# EAGLE design hackerling_b (EAGLE 6.4)
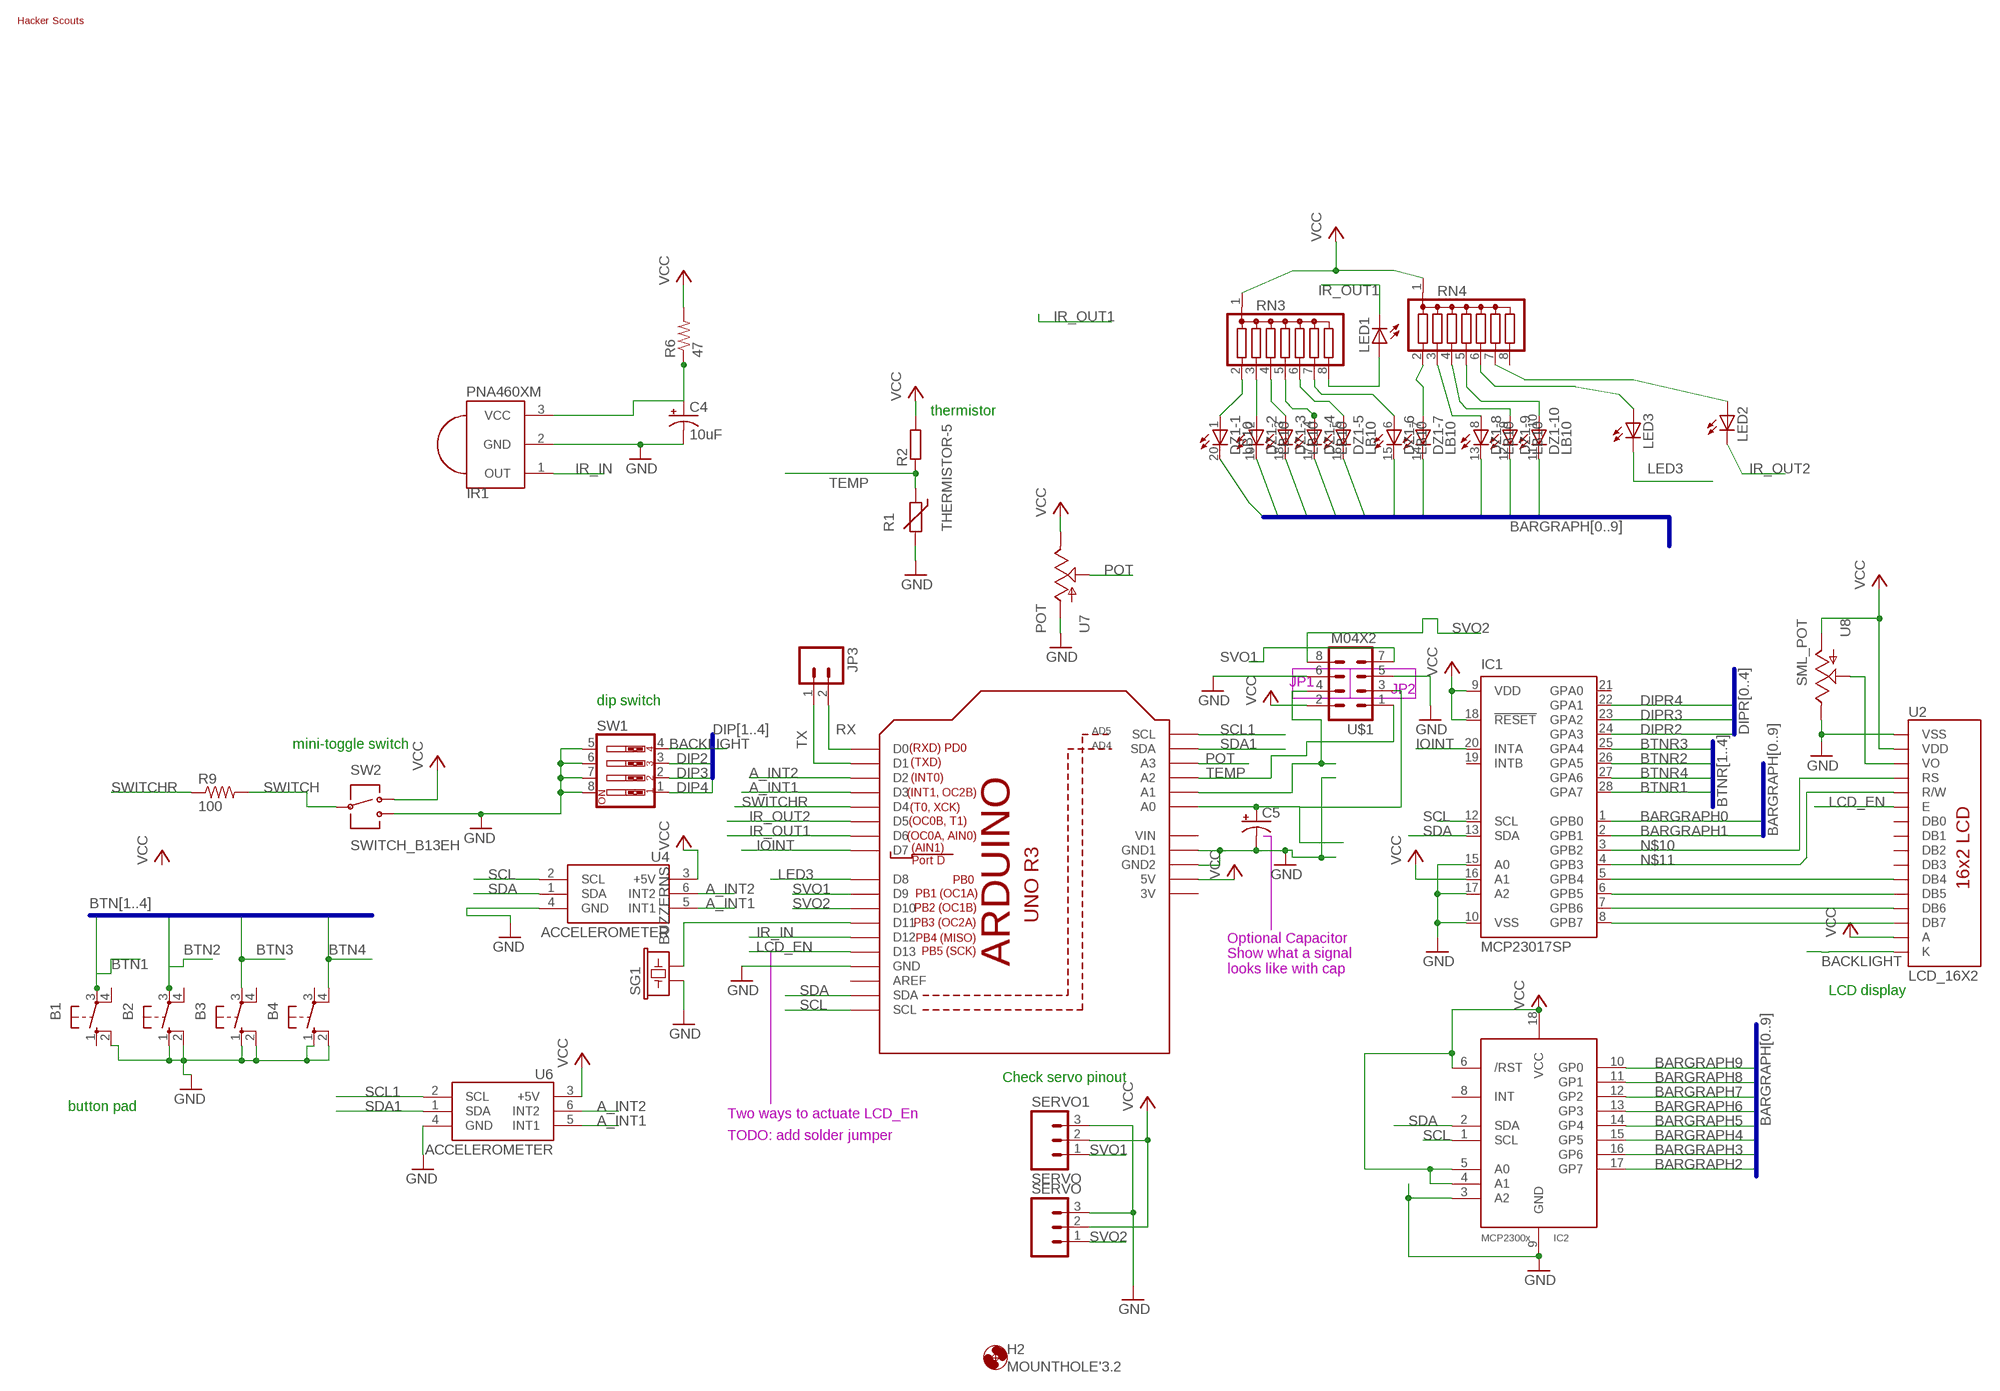
[diagram p0: schematic, sheet 1, part 1 of 2]
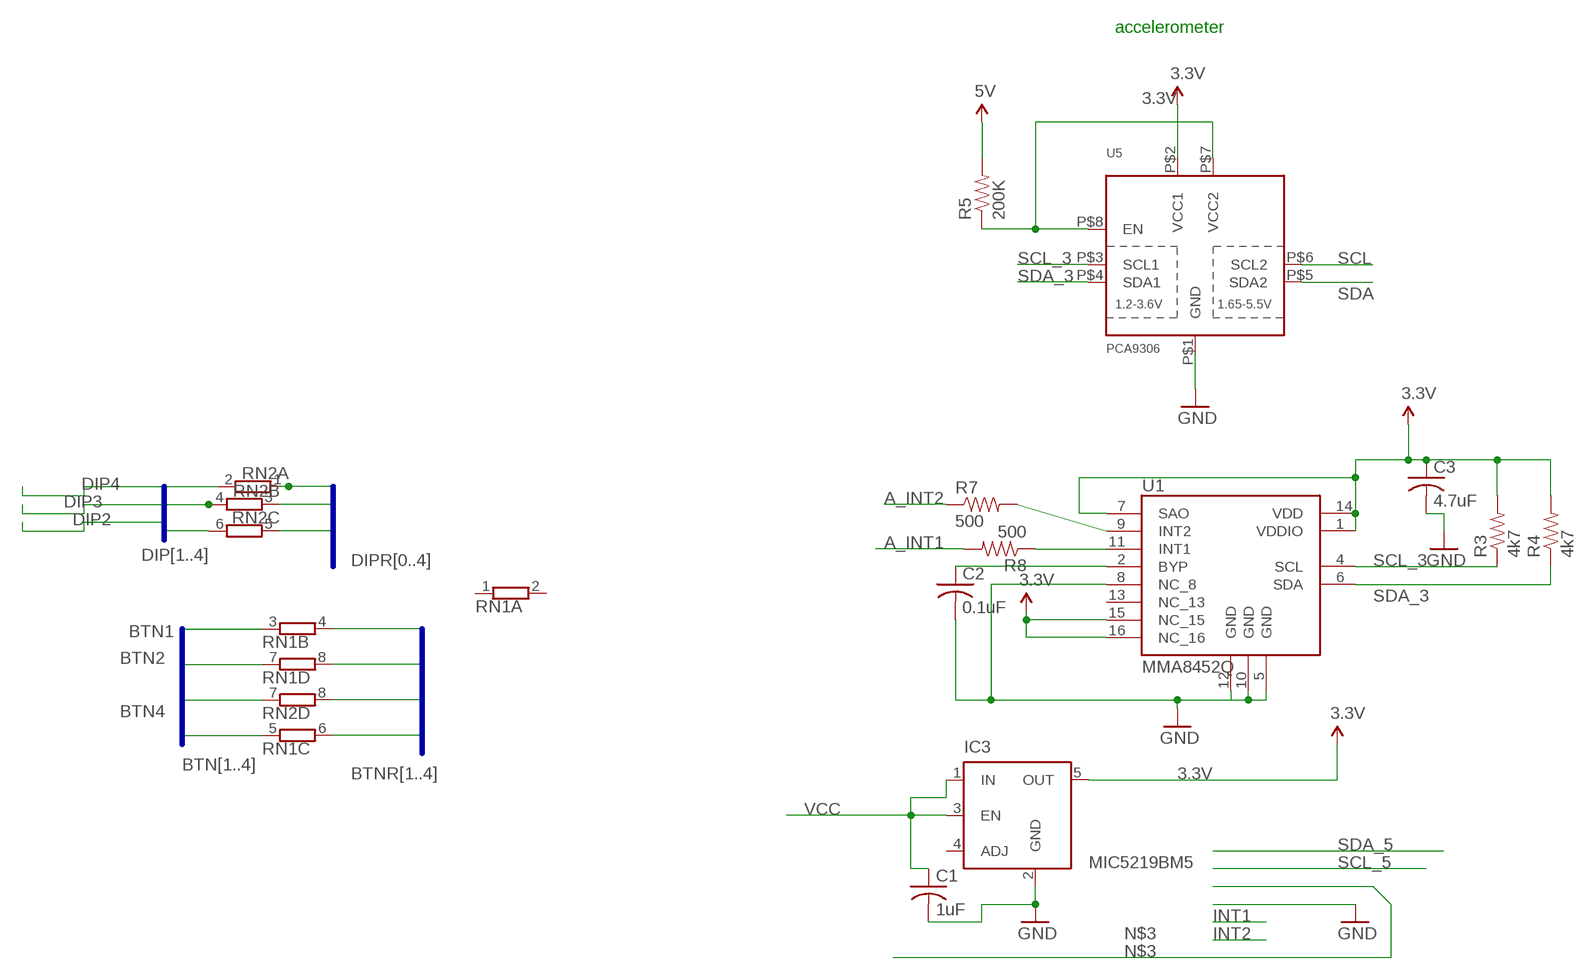
[diagram p1: schematic, sheet 1, part 2 of 2]

## Parts
B1  SWITCH_BCF-4000  [SWITCH_B3F-4000]
B2  SWITCH_BCF-4000  [SWITCH_B3F-4000]
B3  SWITCH_BCF-4000  [SWITCH_B3F-4000]
B4  SWITCH_BCF-4000  [SWITCH_B3F-4000]
C1  1uF  C-USC0603K  [C0603K]
C2  0.1uF  C-USC0603K  [C0603K]
C3  4.7uF  C-USC0603K  [C0603K]
C4  10uF  CAP_050X075  [CAP_050X075]
C5  CPOL-USE5-4  [E5-4]
DZ1  LB10  [LB10]
H2  MOUNTHOLE'3.2  [HOLE_3.2]
HACKERSCOUTSLOGO  HS-LOGO  [HS-LOGO-SM-NOTEXT]
IC1  MCP23017SP  [DIL28-3]
IC2  MCP2300X/P  [DIL18]
IC3  MIC5219BM5  [SOT23-5]
IR1  PNA460XM  [PNA460XM]
JP3  M02LOCK  [1X02_LOCK]
LED1  LED5MM  [LED5MM]
LED2  LED5MM  [LED5MM]
LED3  LED5MM  [LED5MM]
R1  THERMISTOR-5  [R-5]
R2  R-EU_0204/7  [0204/7]
R3  4k7  RESISTOR0603-RES  [0603-RES]
R4  4k7  RESISTOR0603-RES  [0603-RES]
R5  200K  RESISTOR0603-RES  [0603-RES]
R6  47  R-US_0204/7  [0204/7]
R7  500  RESISTOR0603-RES  [0603-RES]
R8  500  RESISTOR0603-RES  [0603-RES]
R9  100  R-US_0204/7  [0204/7]
RN1  E4R  [SIL8]
RN2  E4R  [SIL8]
RN3  G07R  [SIL8]
RN4  G07R  [SIL8]
SERVO  M03LOCK  [1X03_LOCK]
SERVO1  SERVO  M03LOCK  [1X03_LOCK]
SG1  BUZZERNS  [BUZZER-12MM-NS]
SW1  SW_DIP-4  [EDG-04]
SW2  SWITCH_B13EH  [SWITCH_B13EH]
U1  MMA8452Q  [QFN-16(5X3)]
U2  LCD_16X2  [LCD_16X2]
U3  ARDUINOR3-BPLACE  [ARDUINOR3-BPLACE]
U4  ACCELEROMETER  [ACCELEROMETER]
U5  PCA9306  [VSSOP-8]
U6  ACCELEROMETER  [ACCELEROMETER]
U7  POT  [ALS_POT]
U8  SML_POT  [SML_POT]
U$1  M04X2  [2X4]

## Nets
3.3V: C3.1 IC3.5(OUT) R3.2 R4.2 U1.1(VDDIO) U1.7(SAO) U1.14(VDD) U1.15(NC_15) U1.16(NC_16) U5.P$2(VCC1)
A_INT1: R8.2 U3.D3 U4.5(INT1) U6.5(INT1)
A_INT2: R7.1 U3.D2 U4.6(INT2) U6.6(INT2)
BACKLIGHT: SW1.4 U2.16(K)
BARGRAPH0: DZ1.20(-1:C) IC1.1(GPB0)
BARGRAPH1: DZ1.19(-2:C) IC1.2(GPB1)
BARGRAPH2: DZ1.18(-3:C) IC2.17(GP7)
BARGRAPH3: DZ1.17(-4:C) IC2.16(GP6)
BARGRAPH4: DZ1.16(-5:C) IC2.15(GP5)
BARGRAPH5: DZ1.15(-6:C) IC2.14(GP4)
BARGRAPH6: DZ1.14(-7:C) IC2.13(GP3)
BARGRAPH7: DZ1.13(-8:C) IC2.12(GP2)
BARGRAPH8: DZ1.12(-9:C) IC2.11(GP1)
BARGRAPH9: DZ1.11(-10:C) IC2.10(GP0)
BTN1: B1.3(P) RN1.3
BTN2: B2.3(P) RN1.7
BTN3: B3.3(P) RN2.7
BTN4: B4.4(P1) RN1.5
BTNR1: IC1.28(GPA7) RN1.4
BTNR2: IC1.26(GPA5) RN1.8
BTNR3: IC1.25(GPA4) RN2.8
BTNR4: IC1.27(GPA6) RN1.6
DIP2: RN2.6 SW1.3
DIP3: RN2.4 SW1.2
DIP4: RN2.2 SW1.1
DIPR2: IC1.24(GPA3) RN2.5
DIPR3: IC1.23(GPA2) RN2.3
DIPR4: IC1.22(GPA1) RN2.1
GND: B1.2(S1) B2.1(S) B2.2(S1) B3.1(S) B3.2(S1) B4.1(S) B4.2(S1) C1.2 C2.2 C3.2 C4.2(-) C5.- IC1.10(VSS) IC1.15(A0) IC1.17(A2) IC2.3(A2) IC2.9(GND) IC3.2(GND) IR1.2(GND) R1.2 SERVO1.3 SERVO.3 SG1.+ SW1.5 SW1.6 SW1.7 SW1.8 SW2.3 U1.5(GND) U1.8(NC_8) U1.10(GND) U1.12(GND) U2.1(VSS) U2.B1(VSS) U3.GND U3.GND1 U3.GND2 U4.4(GND) U5.P$1(GND) U6.4(GND) U7.P$1(A) U8.E U$1.5 U$1.6
IOINT: IC1.20(INTA) U3.D7
IR_IN: IR1.1(OUT) U3.D12
IR_OUT1: LED1.K(C) U3.D6
IR_OUT2: LED2.K(C) U3.D5
LCD_EN: U2.6(E) U3.D13
LED3: LED3.K(C) U3.D8
N$1: IC1.8(GPB7) U2.14(DB7)
N$2: IC1.7(GPB6) U2.13(DB6) U2.B13(DB6)
N$3: IC1.6(GPB5) U2.12(DB5) U2.B12(DB5)
N$4: IC1.5(GPB4) U2.11(DB4)
N$5: R5.1 U5.P$7(VCC2) U5.P$8(EN)
N$6: R7.2 U1.9(INT2)
N$7: R8.1 U1.11(INT1)
N$8: DZ1.2(-2:A) RN3.3
N$9: DZ1.3(-3:A) RN3.4
N$10: IC1.3(GPB2) U2.4(RS)
N$11: IC1.4(GPB3) U2.5(R/W)
N$12: LED2.A RN4.7
N$13: U2.3(VO) U8.S
N$15: SG1.- U3.D11
N$16: DZ1.7(-7:A) RN4.2
N$17: DZ1.6(-6:A) RN3.7
N$18: DZ1.1(-1:A) RN3.2
N$19: C4.1(+) IR1.3(VCC) R6.1
N$20: LED3.A RN4.6
N$21: DZ1.4(-4:A) RN3.5
N$22: DZ1.5(-5:A) RN3.6
N$24: U3.A1 U$1.4
N$25: C2.1 U1.2(BYP)
N$26: C5.+ U3.A0 U$1.3
N$29: DZ1.8(-8:A) RN4.3
N$30: DZ1.9(-9:A) RN4.4
N$31: DZ1.10(-10:A) RN4.5
N$32: LED1.A RN3.8
POT: U3.A3 U7.P$2(S)
RX: JP3.2 U3.D0
SCL: IC1.12(SCL) IC2.1(SCL) U3.SCL U4.2(SCL) U5.P$6(SCL2)
SCL1: U3.A5(SCL) U6.2(SCL)
SCL_3: R3.1 U1.4(SCL) U5.P$3(SCL1)
SDA: IC1.13(SDA) IC2.2(SDA) U3.SDA U4.1(SDA) U5.P$5(SDA2)
SDA1: U3.A4(SDA) U6.1(SDA)
SDA_3: R4.1 U1.6(SDA) U5.P$4(SDA1)
SVO1: SERVO1.1 U3.D9 U$1.7
SVO2: SERVO.1 U3.D10 U$1.8
SWITCH: R9.2 SW2.2
SWITCHR: R9.1 U3.D4
TEMP: R1.1 R2.1 U3.A2 U$1.1
TX: JP3.1 U3.D1
VCC: C1.1 IC1.9(VDD) IC1.16(A1) IC1.18(!RESET) IC2.4(A1) IC2.5(A0) IC2.6(/RST) IC2.18(VCC) IC3.1(IN) IC3.3(EN) R2.2 R5.2 R6.2 RN3.1 RN4.1 SERVO1.2 SERVO.2 SW2.1 U2.2(VDD) U2.15(A) U2.B2(VDD) U3.5V U4.3(+5V) U6.3(+5V) U7.P$3(E) U8.A U$1.2 ; supply symbol labelled 5V
Unconnected: B1.1(S) B1.4(P1) B2.4(P1) B3.4(P1) B4.3(P) IC1.19(INTB) IC1.21(GPA0) IC2.8(INT) IC3.4(ADJ) RN1.1 RN1.2 RN4.8 U1.13(NC_13) U2.7(DB0) U2.8(DB1) U2.9(DB2) U2.10(DB3) U3.AREF

## Buses
BARGRAPH[0..9]
DIPR[0..4]
BTN[1..4]
BTNR[1..4]
DIP[1..4]

## Notes on the sheet
- thermistor | accelerometer
- JP1
- JP2
- dip switch
- mini-toggle switch
- Optional Capacitor 
  Show what a signal
  looks like with cap
- LCD display
- Check servo pinout
- button pad
- Two ways to actuate LCD_En
- TODO: add solder jumper

## Power pins joined to a net without a drawn wire
3V: U3.3V
VIN: U3.VIN

## Library data of the parts
B1-B4 = hackerscouts:SWITCH_BCF-4000
C1-C3 = resistor:C-US: CAPACITOR, American symbol
C4 = hackerscouts:CAP_050X075
C5 = rcl:CPOL-US: POLARIZED CAPACITOR, American symbol
DZ1 = led:LB10: LED BLOCK 10-LED bar graph, DIL, Siemens
H2 = hackerscouts:MOUNTHOLE
HACKERSCOUTSLOGO = hackerscouts:HS-LOGO
IC1 = adafruit:MCP23017: http://ww1.microchip.com/downloads/en/DeviceDoc/21952a.pdf Source: http://ww1.microchip.com/downloads/en/DeviceDoc/21952a.pdf
IC2 = adafruit:MCP2300X: MCP23008 Inexpensive i2c i/o expander - 8 general purpose i/o pins with optional pullups
IC3 = v-reg-micrel:MIC5219BM5: VOLTAGE REGULATOR; MF: ALTERA CORPORATION; MPN: MIC5219BM5 TR; OC_FARNELL: 1100656; OC_NEWARK: 09J8939
IR1 = adafruit:PNA460XM: IR 38KHz receiver PNA4602 and related receivers http://www.ladyada.net/library/pcb/eaglelibrary.html
JP3 = SparkFun:M02: Header 2 Standard 2-pin 0.1" header. Use with straight break away headers (SKU : PRT-00116), right angle break away headers (PRT-00553), swiss pins (PRT-00743), machine pins (PRT-00117), and female headers (PRT-00115). Molex polarized connector foot print use with SKU : PRT-08233 with associated crimp pins and housings.
LED1-LED3 = SparkFun:LED: LEDs Standard schematic elements and footprints for 5mm, 3mm, 1206, and 0603 sized LEDs. 5mm - Spark Fun Electronics SKU : COM-00529 (and others)
R1 = varistor:THERMISTOR: THERMISTOR
R2 = resistor:R-EU_: RESISTOR, European symbol
R3-R5 R7 R8 = SparkFun:RESISTOR: Resistor Basic schematic elements and footprints for 0603, 1206, and PTH resistors.
R6 R9 = resistor:R-US_: RESISTOR, American symbol
RN1 RN2 = resistor-sil:E4R: SIL RESISTOR; OC_FARNELL: unknown; OC_NEWARK: unknown
RN3 RN4 = resistor-sil:G07R: SIL RESISTOR; OC_FARNELL: unknown; OC_NEWARK: unknown
SERVO SERVO1 = SparkFun:M03: Header 3 Standard 3-pin 0.1" header. Use with straight break away headers (SKU : PRT-00116), right angle break away headers (PRT-00553), swiss pins (PRT-00743), machine pins (PRT-00117), and female headers (PRT-00115). Molex polarized connector foot print use with SKU : PRT-08232 with associated crimp pins and housings.
SG1 = SparkFun:BUZZER: Buzzer 12mm Spark Fun Electronics SKU : Comp-Buzzer
SW1 = special:SW_DIP-4: DIP SWITCH
SW2 = hackerscouts:SWITCH_B13EH
U1 = hackerscouts:MMA8452Q
U2 = hackerscouts:LCD_16X2
U3 = adafruit:ARDUINOR3: This is a new object for the new Arduino R3 - with extra pins that you may want to use (such as IOref, and duplicated A4/A5
U4 U6 = hackerscouts:ACCELEROMETER
U5 = hackerscouts:PCA9306
U7 = hackerscouts:POT
U8 = hackerscouts:SML_POT
U$1 = SparkFun:M04X2

## Board
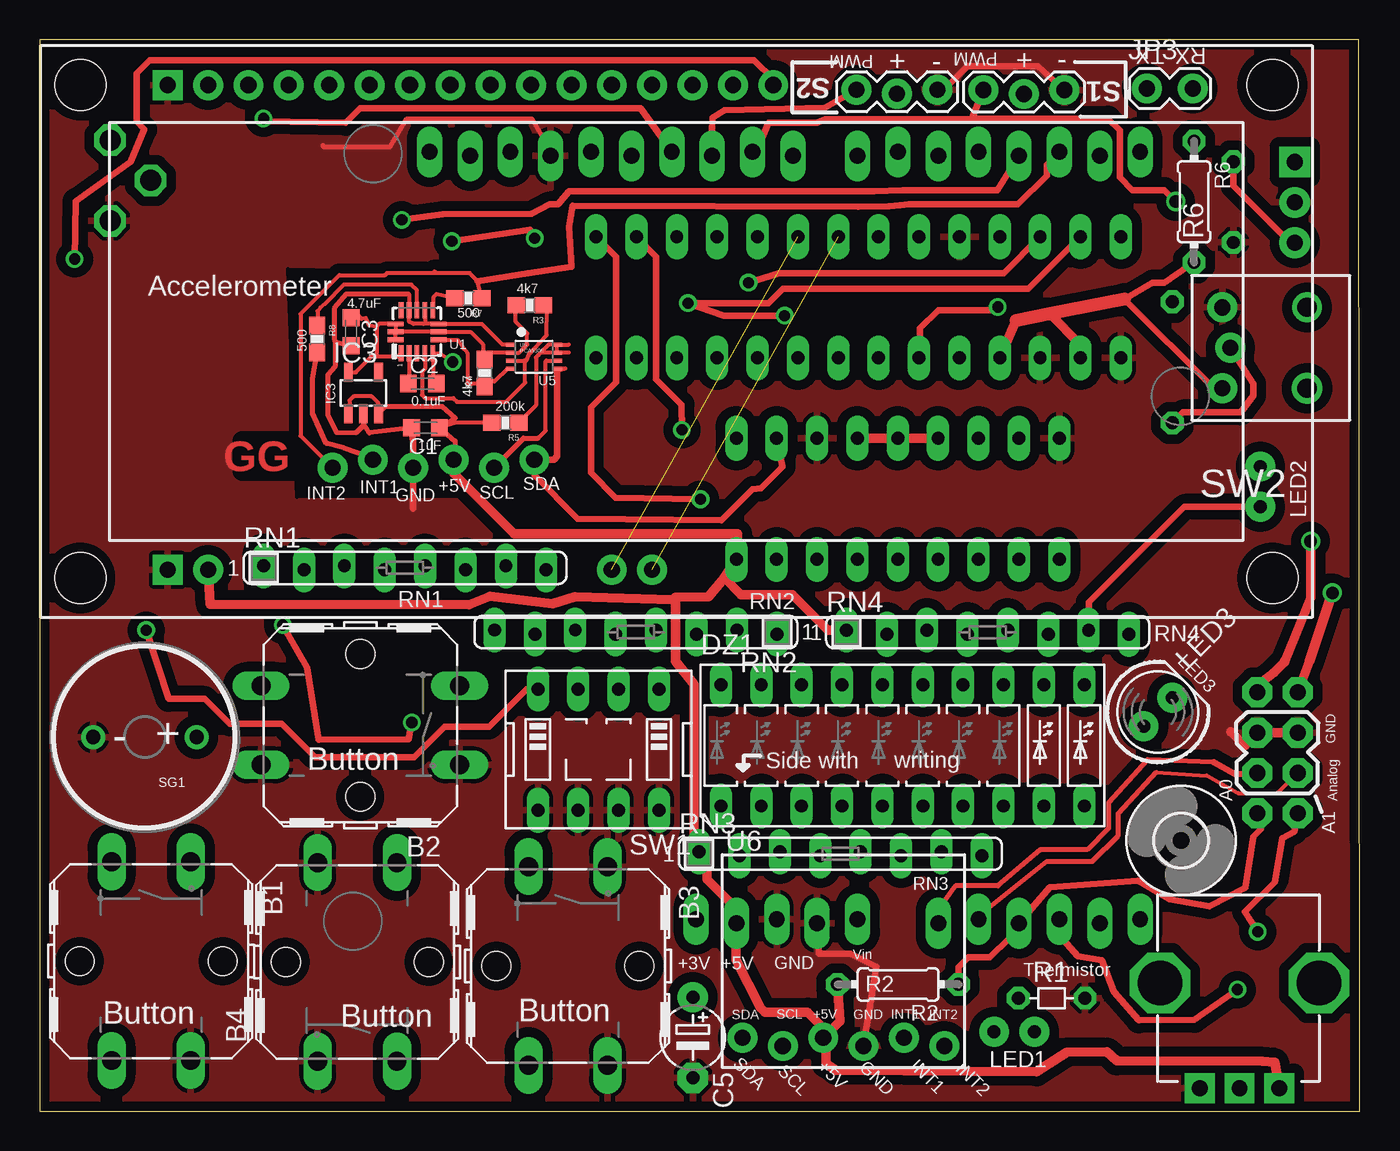
[diagram p2: board, top side]
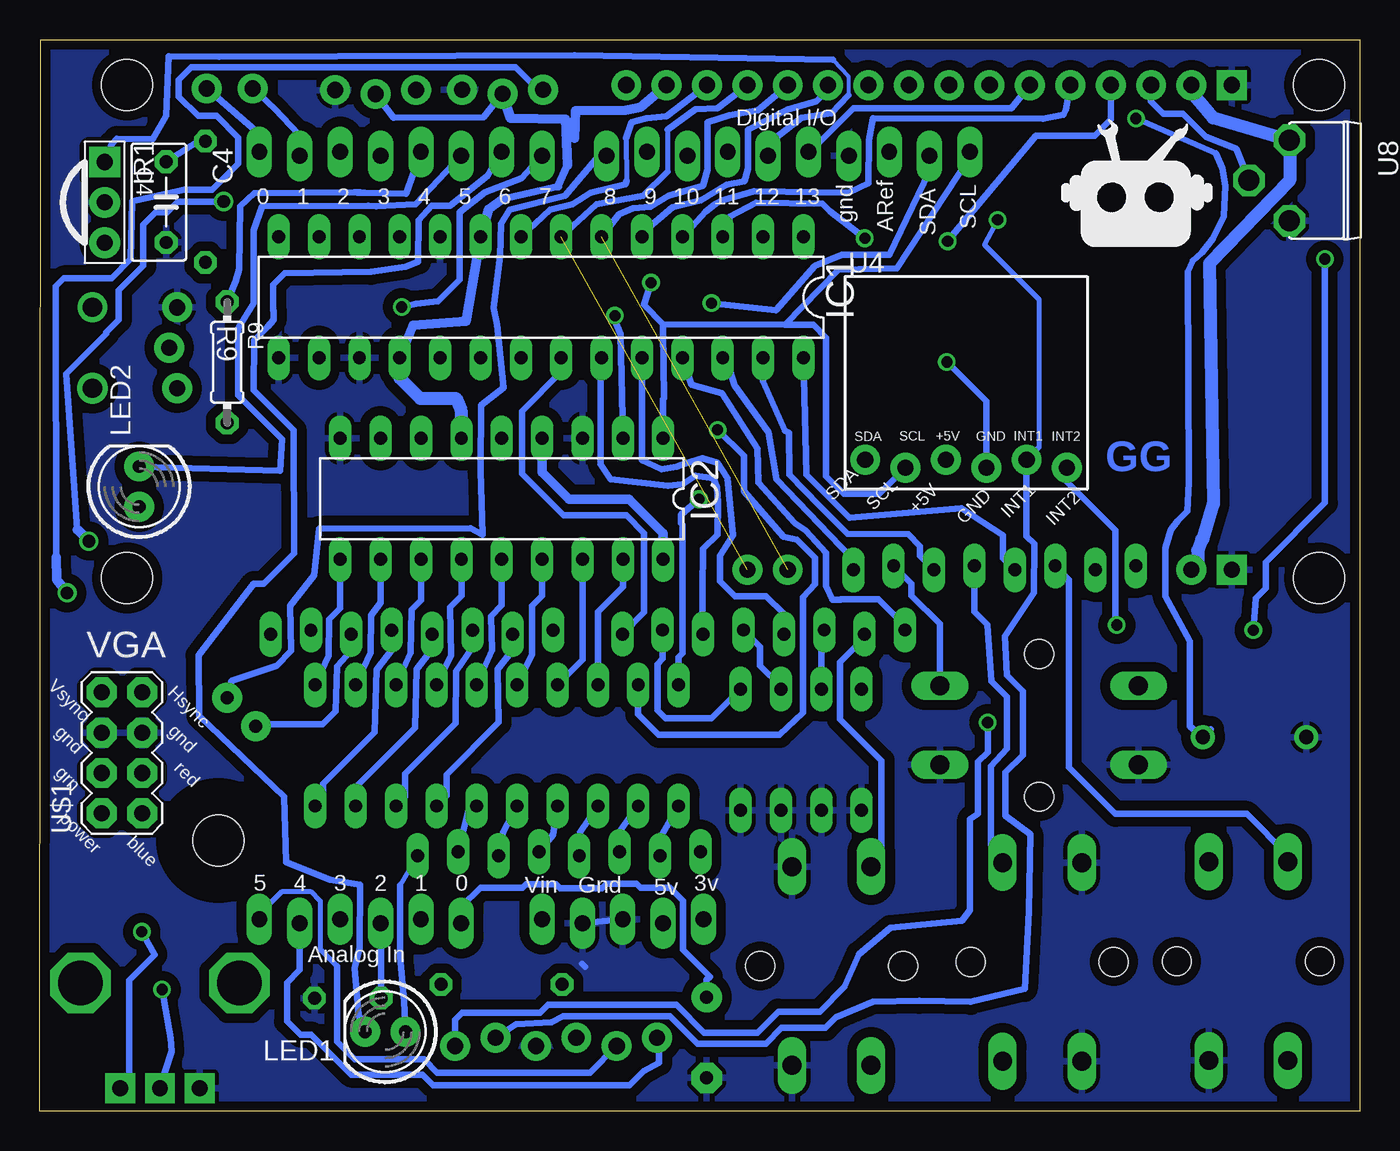
[diagram p3: board, bottom side, seen from below]

Size 83.05 x 67.38 mm. Coordinates in mm from the lower left corner, seen from the top.
Outline: 0,67.38 0,0 83.05,0 83,67.38 0,67.38
Copper layers (1*16): Top 0.035mm / dielectric 1.5mm / Bottom 0.035mm
Design rules "default *": minimum track width 8mil, minimum drill 24mil, track to track 8mil, track to pad 8mil, pad to pad 8mil, via to via 8mil, smd to smd 8mil, copper to edge 15mil, drill to drill 8mil, minimum pad ring 12mil, minimum via ring 8mil, stop-mask expansion 3mil, vias tented up to drill 0mil, thermal gap 10mil

### Footprints (pad centres in the part's own frame; a part is rotated, then mirrored left to right if it is on the bottom)
SWITCH_B3F-4000 = drill 1.194 long: 1 -6.248,2.489; 2 6.248,2.489; 3 -6.248,-2.489; 4 6.248,-2.489 | hole 1.803: 0,-4.496; 0,4.496
C0603K = smd 1.05 x 1.08: 1 -0.875,0; 2 0.875,0
CAP_050X075 = drill 0.813 octagon: 1 -2.54,0; 2 2.54,0
E5-4 = drill 0.813 pad 1.905: + -2.54,0 | drill 0.813 pad 1.905 octagon: - 2.54,0
LB10 = drill 0.813 long: 1 -11.43,-3.81; 2 -8.89,-3.81; 3 -6.35,-3.81; 4 -3.81,-3.81; 5 -1.27,-3.81; 6 1.27,-3.81; 7 3.81,-3.81; 8 6.35,-3.81; 9 8.89,-3.81; 10 11.43,-3.81; 11 11.43,3.81; 12 8.89,3.81; 13 6.35,3.81; 14 3.81,3.81; 15 1.27,3.81; 16 -1.27,3.81; 17 -3.81,3.81; 18 -6.35,3.81; 19 -8.89,3.81; 20 -11.43,3.81
HOLE_3.2 = hole 3.2: 0,0
DIL28-3 = drill 0.813 long: 1 -16.51,-3.81; 2 -13.97,-3.81; 3 -11.43,-3.81; 4 -8.89,-3.81; 5 -6.35,-3.81; 6 -3.81,-3.81; 7 -1.27,-3.81; 8 1.27,-3.81; 9 3.81,-3.81; 10 6.35,-3.81; 11 8.89,-3.81; 12 11.43,-3.81; 13 13.97,-3.81; 14 16.51,-3.81; 15 16.51,3.81; 16 13.97,3.81; 17 11.43,3.81; 18 8.89,3.81; 19 6.35,3.81; 20 3.81,3.81; 21 1.27,3.81; 22 -1.27,3.81; 23 -3.81,3.81; 24 -6.35,3.81; 25 -8.89,3.81; 26 -11.43,3.81; 27 -13.97,3.81; 28 -16.51,3.81
DIL18 = drill 0.813 long: 1 -10.16,-3.81; 2 -7.62,-3.81; 3 -5.08,-3.81; 4 -2.54,-3.81; 5 0,-3.81; 6 2.54,-3.81; 7 5.08,-3.81; 8 7.62,-3.81; 9 10.16,-3.81; 10 10.16,3.81; 11 7.62,3.81; 12 5.08,3.81; 13 2.54,3.81; 14 0,3.81; 15 -2.54,3.81; 16 -5.08,3.81; 17 -7.62,3.81; 18 -10.16,3.81
SOT23-5 = smd 0.55 x 1.2: 1 -0.95,-1.3; 2 0,-1.3; 3 0.95,-1.3; 4 0.95,1.3; 5 -0.95,1.3
PNA460XM = drill 1.016 pad 1.93 square: 1 -2.54,0 | drill 1.016 pad 1.93: 2 0,0; 3 2.54,0
1X02_LOCK = drill 1.016 pad 1.88: 1 -0.178,0; 2 2.718,0
LED5MM = drill 0.813 pad 1.88: A -1.27,0; K 1.27,0
R-5 = drill 0.813 octagon: 1 -2.159,0; 2 2.032,0
0204/7 = drill 0.813 octagon: 1 -3.81,0; 2 3.81,0
0603-RES = smd 1.1 x 1: 1 -0.85,0; 2 0.85,0
SIL8 = drill 0.813 long: 1 -8.89,0.127; 2 -6.35,-0.127; 3 -3.81,0.127; 4 -1.27,-0.127; 5 1.27,0.127; 6 3.81,-0.127; 7 6.35,0.127; 8 8.89,-0.127
1X03_LOCK = drill 1.016 pad 1.88: 1 0,0.127; 2 2.54,-0.127; 3 5.08,0.127
BUZZER-12MM-NS = drill 0.9: + 3.25,0; - -3.25,0
EDG-04 = drill 0.813 long: 1 -3.81,-3.81; 2 -1.27,-3.81; 3 1.27,-3.81; 4 3.81,-3.81; 5 3.81,3.81; 6 1.27,3.81; 7 -1.27,3.81; 8 -3.81,3.81
SWITCH_B13EH = drill 1.016 pad 1.88: 1 0.254,2.54; 2 -0.254,0; 3 0.254,-2.54 | drill 1.2 pad 1.88: BR1 -5.08,-2.54 | drill 1.2 pad 1.93: BR2 -5.08,2.54
QFN-16(5X3) = smd 1 x 0.295: 1 -1.35,1; 2 -1.35,0.5; 3 -1.35,0; 4 -1.35,-0.5; 5 -1.35,-1; 9 1.35,-1; 10 1.35,-0.5; 11 1.35,0; 12 1.35,0.5; 13 1.35,1 | smd 0.295 x 1: 6 -0.5,-1.35; 7 0,-1.35; 8 0.5,-1.35; 14 0.5,1.35; 15 0,1.35; 16 -0.5,1.35
LCD_16X2 = drill 1.016 pad 1.88 square: 1 -32,15.5; B1 -32,-14.98 | drill 1.016 pad 1.88: 2 -29.46,15.5; 3 -26.92,15.5; 4 -24.38,15.5; 5 -21.84,15.5; 6 -19.3,15.5; 7 -16.76,15.5; 8 -14.22,15.5; 9 -11.68,15.5; 10 -9.14,15.5; 11 -6.6,15.5; 12 -4.06,15.5; 13 -1.52,15.5; 14 1.02,15.5; 15 3.56,15.5; 16 6.1,15.5; B2 -29.46,-14.98; B12 -4.06,-14.98; B13 -1.52,-14.98 | hole 3.2: -37.5,15.5; -37.5,-15.5; 37.5,15.5; 37.5,-15.5
ARDUINOR3-BPLACE = drill 1 pad 1.422 long: 3V 35.56,2.667; 5V 38.1,2.413; A0 50.8,2.413; A1 53.34,2.667; A2 55.88,2.413; A3 58.42,2.667; A4 60.96,2.413; A5 63.5,2.667; AREF 23.876,50.927; D0 63.5,50.927; D1 60.96,50.673; D2 58.42,50.927; D3 55.88,50.673; D4 53.34,50.927; D5 50.8,50.673; D6 48.26,50.927; D7 45.72,50.673; D8 41.656,50.673; D9 39.116,50.927; D10 36.576,50.673; D11 34.036,50.927; D12 31.496,50.673; D13 28.956,50.927; GND 26.416,50.673; GND1 43.18,2.413; GND2 40.64,2.667; SCL 18.796,50.927; SDA 21.336,50.673; VIN 45.72,2.667
ACCELEROMETER = drill 1.016 pad 1.88: 1 -6.35,-4.826; 2 -3.81,-5.334; 3 -1.27,-4.826; 4 1.27,-5.334; 5 3.81,-4.826; 6 6.35,-5.334
VSSOP-8 = smd 0.25 x 0.65: P$1 -0.75,-1.45; P$2 -0.25,-1.45; P$3 0.25,-1.45; P$4 0.75,-1.45; P$5 0.75,1.45; P$6 0.25,1.45; P$7 -0.25,1.45; P$8 -0.75,1.45
ALS_POT = drill 1 pad 1.88 square: P$1 6.3,-2.5; P$2 6.3,0; P$3 6.3,2.5 | drill 2.8 octagon: P$4 -0.318,-5 | drill 2.8 pad 3.302 octagon: P$5 -0.318,5
SML_POT = drill 1.321 octagon: A -2.54,0; E 2.54,0; S 0,-2.54
2X4 = drill 1.016 pad 1.88 octagon: 1 -3.81,-1.27; 2 -3.81,1.27; 3 -1.27,-1.27; 4 -1.27,1.27; 5 1.27,-1.27; 6 1.27,1.27; 7 3.81,-1.27; 8 3.81,1.27

### Placement (x,y rotation side)
B1  7.01,9.43 270 top
B2  20.17,24.26 180 top
B3  33.23,9.12 270 top
B4  19.98,9.38 90 top
C1  24.27,42.98 180 top
C2  24.07,45.75 0 top
C3  19.59,49.01 270 top
C4  75.09,57.17 270 bottom
C5  41.09,4.62 270 top
DZ1  54.28,23 0 top
H2  71.81,17.02 270 top
HACKERSCOUTSLOGO  14.07,57.49 0 bottom
IC1  51.51,51.18 180 bottom
IC2  53.98,38.51 180 bottom
IC3  20.36,45.16 0 top
IR1  78.96,57.15 270 bottom
JP3  69.82,64.31 0 top
LED1  61.31,4.98 180 bottom
LED2  76.8,39.27 90 bottom
LED3  70.35,25.1 45 top
R1  63.73,7.1 0 top
R2  54,7.96 180 top
R3  30.84,50.68 180 top
R4  28,46.42 90 top
R5  29.29,43.3 180 top
R6  72.62,57.19 270 top
R7  26.96,51.11 180 top
R8  17.46,48.56 270 top
R9  71.25,47.09 270 bottom
RN1  22.98,34.16 0 top
RN2  37.51,30.13 180 top
RN3  50.38,16.18 0 top
RN4  59.64,30.12 0 top
SERVO  51.39,64.1 0 top
SERVO1  59.38,64.09 0 top
SG1  6.62,23.52 180 top
SW1  35.15,22.73 180 top
SW2  74.66,48 180 top
U1  23.73,49.01 90 top
U2  40.05,49.03 0 top
U3  5.73,9.4 0 top
U4  24.77,45.79 0 bottom
U5  31.1,47.45 270 top
U6  50.56,9.43 0 top
U7  75.49,7.73 270 top
U8  4.43,58.53 270 bottom
U$1  77.88,22.53 90 bottom

### Tracks (layer width: path | path; a pad name or v marks a point on that pad's centre or on a via)
3.3V
  Top 0.254: IC3.5 19.89,46.46 20.89,47.46 21.29,47.46 | 21.29,47.46 22.54,47.46 U1.1 | 21.18,49.34 21.34,49.51 U1.14 U1.15 | 21.18,49.34 21.18,47.56 21.29,47.46 | 21.18,49.34 20.75,49.39 20.52,49.87 20.24,49.82 19.94,50.16 C3.1 | R3.2 29.95,50.64 29.95,49.64 30.67,48.92 30.67,48.2 30.16,47.7 U5.P$2 28.18,47.7 R4.2 27.89,47.38 27.89,48.23 27.11,49.01 U1.7 U1.15 | U1.16 U1.15
A_INT1  (via drill 0.7 pad 0.41)
  Top 0.254: 20.77,41.16 U4.5
  Top 0.305: R8.2 17.16,46.05 17.16,43.9 18.03,41.99 19.11,41.73 20.77,41.16
  Top 0.406: U3.D3 60.25,57.9 54.3,57.9 52.48,57.86 33.31,57.85 32.61,57.04 32.06,57.02 30.93,56.42 25.34,56.42 v22.78,56.05 | U4.5 20.98,40.95
  Bottom 0.305: v22.78,56.05 23.61,54.48 20.18,51.05 20.18,41.75 U4.5
  Bottom 0.406: U6.5 53.09,5.46 50.84,5.58 50.12,5.95 48.43,5.95 43.39,5.95 41.68,4.24 37.36,4.24 36.37,5.23 33.61,5.23 32.95,5.89 30.64,6.88 27.72,6.92 24.5,6.87 21.07,7.68 20.81,12.57 20.73,17.4 22.3,18.58 22.3,21.29 21.2,22.39 21.2,26.41 22.2,27.42 22.34,29.87 20.52,32.6 20.47,35.67 20.96,36.16 U4.5
A_INT2  (via drill 0.7 pad 0.41)
  Top 0.254: R7.1 27.54,52.2 27.05,52.69 24.95,52.69 | 24.95,52.69 21.84,52.69 21.71,52.57 18.84,52.57 16.41,50.14 16.41,42.46 U4.6 | 24.84,52.81 24.95,52.69
  Top 0.406: U3.D2 63.35,59.52 63.35,58.84 61.54,57.03 54.69,57.03 54.12,56.96 53.42,56.9 51.52,56.87 33.52,56.94 33.32,55.63 33.46,53.09 30.73,52.69 27.54,52.2 | v23.41,24.44 23.22,23.37 17.55,23.34 16.81,27.88 v15.29,30.57
  Bottom 0.406: U4.6 18.42,39.57 15.39,36.54 15.39,30.97 v15.29,30.57 | U6.6 56.91,5.75 56.49,6.17 51.59,6.17 51.08,6.68 43,6.68 41.25,4.93 37.9,4.93 36.58,6.25 33.97,6.25 32.42,7.8 31.52,9.86 29.54,11.53 25.03,11.96 24.52,12.62 24.52,18.35 24.02,18.7 24.02,20 24.02,21.96 23.41,22.56 v23.41,24.44
BACKLIGHT  (via drill 0.7 pad 0.41)
  Top 0.406: U2.16 46.15,64.88 44.94,66.1 6.91,66.1 6.08,65.28 6.08,62.25 6.58,61.75 5.73,59.71 2.26,57.22 v2.19,53.59 | SW1.4 30.62,26.54 28.27,24.18 25.48,24.18 23.56,22.26 17.34,22.26 15.23,24.36 11.96,24.36 10.39,25.93 8.11,25.93 v6.7,30.24
  Bottom 0.406: v6.7,30.24 6.54,32.25 5.92,32.87 5.92,34.53 2.19,38.25 v2.19,53.59
BARGRAPH0  (via drill 0.7 pad 0.41)
  Top 0.406: v41.57,38.48 36.23,38.59 34.68,40.14 34.68,44.27 36.26,45.84 36.26,53.73 IC1.1
  Bottom 0.406: DZ1.20 42.85,28.55 42.61,28.79 42.61,36.89 42.7,36.98 42.7,37.5 v41.57,38.48
BARGRAPH1  (via drill 0.7 pad 0.41)
  Top 0.406: v40.41,42.84 40.38,44.42 38.78,46.02 38.78,53.74 IC1.2
  Bottom 0.406: DZ1.19 45.4,24.94 44.12,23.66 36.49,23.66 35.05,25.04 35.05,32.3 34.27,33.15 34.27,34.79 35.41,35.93 36.27,36.11 38.74,38.99 38.74,41.22 v40.41,42.84
BARGRAPH2
  Bottom 0.406: IC2.17 46.37,32.96 47.94,31.39 DZ1.18
BARGRAPH3
  Bottom 0.406: IC2.16 48.91,28.38 DZ1.17
BARGRAPH4
  Bottom 0.406: IC2.15 51.45,32.42 52.09,31.78 52.07,28.73 DZ1.16
BARGRAPH5
  Bottom 0.406: IC2.14 53.98,31.8 54.66,31.13 54.59,28.98 DZ1.15
BARGRAPH6
  Bottom 0.406: IC2.13 56.52,32.4 57.23,31.7 57.17,28.67 DZ1.14
BARGRAPH7
  Bottom 0.406: IC2.12 59.06,32.13 59.66,31.53 59.72,28.84 DZ1.13
BARGRAPH8
  Bottom 0.406: IC2.11 61.6,31.98 62.22,31.19 62.23,28.83 DZ1.12
BARGRAPH9
  Bottom 0.406: IC2.10 64.14,31.62 64.84,30.92 64.86,28.63 DZ1.11
BTN1
  Bottom 0.406: B1.3 4.52,16.1 7.11,18.69 15.38,18.69 18.3,21.61 18.3,33.42 RN1.3
BTN2
  Bottom 0.406: B2.3 26.42,30.63 28.2,32.42 28.2,33.17 RN1.7
BTN3
  Bottom 0.406: RN2.7 31.16,29.78 32.7,28.23 32.7,24.65 30.09,22.03 30.09,16.03 B3.3
BTN4
  Bottom 0.406: RN1.5 24.25,31.4 23.44,30.59 23.18,27.02 22.2,26.04 22.2,22.79 23.2,21.69 23.2,16.74 B4.4
BTNR1
  Bottom 0.406: IC1.28 34.8,40.02 32.09,37.31 25.07,37.92 22.45,36.23 22.45,34.78 RN1.4
BTNR2
  Bottom 0.406: RN1.8 31.98,34.81 36.7,39.73 37.2,42.7 39.34,45.66 39.79,47.08 IC1.26
BTNR3
  Bottom 0.406: IC1.25 42.05,45.69 40.12,45.16 37.88,41.65 37.84,39.5 35.52,36.96 34.83,36.51 33.58,35.1 33.58,33.04 33.17,32.15 32.67,32.15 32.63,32.19 30.27,32.19 28.61,30.54 RN2.8
BTNR4
  Bottom 0.406: IC1.27 37.54,45.89 36.17,42.78 35.91,42.65 35.88,40.03 33.99,38.08 32.22,36.31 28.41,36.26 27.68,35.53 27.68,34.93 RN1.6
DIP2
  Bottom 0.406: RN2.6 33.88,30.07 SW1.3
DIP3
  Bottom 0.406: RN2.4 37.73,29.21 37.73,28.02 36.42,26.71 SW1.2
DIP4
  Bottom 0.406: RN2.2 43.85,28.45 44.2,28.11 44.2,25.22 43.7,24.72 40.78,24.72 SW1.1
DIPR2
  Bottom 0.406: IC1.24 45.16,40.92 43.92,40.38 42.99,40.53 42.38,40.76 41.35,41.04 40.41,40.76 39.77,39.81 39.42,36.23 40.25,34.92 40.25,33.31 39.31,32.37 37.34,32.37 36.23,31.26 RN2.5
DIPR3
  Bottom 0.406: IC1.23 47.76,47.31 47.76,40.69 47.15,39.73 43.53,39.32 42.62,39.41 41.79,39.94 40.66,39.8 40.45,39.2 40.37,38.3 40.4,36.25 41.31,35.37 41.38,30.07 RN2.3
DIPR4
  Bottom 0.406: RN2.1 45.02,31.37 45.02,36.34 46.15,37.47 50.1,37.47 52.72,40.08 52.72,44.02 50.24,46.49 IC1.22
GND  (via drill 0.7 pad 0.3)
  Top 0.254: U5.P$1 29.11,48.2 27.8,49.51 U1.8 23.51,49.51 | C2.2 24.73,45.97 U1.5 25.18,47.66 v25.98,47.11 | U1.10 24.23,49.55 24.12,49.51 23.51,49.51 | 23.51,49.51 23.24,49.63 U1.12 23.23,51.36 23.2,51.39 | 20.41,43.17 20.41,43.82 IC3.2 | 18.59,48.37 18.59,48.32 18.56,48.48
  Top 0.305: U3.GND 32.15,60.41 31,62.37 23.06,62.37 22,60.62 17.92,60.62 17.82,60.72 | C1.2 20.73,42.66 20.41,43.17 19.91,42.67 18.66,42.68 18.12,43.8 18.12,46.31 18.59,46.85 18.59,48.37 C3.2 | 18.56,48.48 18.56,50.52 19.3,51.39 23.2,51.39
  Top 0.406: SERVO.3 56.87,64.21 58.35,65.71 62.81,65.71 SERVO1.3 | C1.2 23.5,42.09 U4.4 23.5,37.89 | U6.4 52.65,9.07 51.01,9.9 49.02,9.88 U3.GND1
  Top 0.61: 74.93,23.85 75.82,22.96 U$1.5 U$1.6
  Bottom 0.406: U3.GND2 U3.GND1 | 57.86,55.33 IC1.10 | v25.98,47.11 23.5,44.63 U4.4 | 48.91,10.98 48.92,10.97 | 48.92,9.25 48.73,9.07
  Bottom 0.813: 48.97,12 U3.GND1
  pour Top (isolate 0.61): 0.15,67.19 0.16,-0.26 83.03,-0.33 82.96,67.13
  pour Bottom (isolate 0.61): 0.16,67.19 0.17,-0.25 83.03,-0.31 82.97,67.15
IOINT  (via drill 0.7 pad 0.41)
  Top 0.406: IC1.20 55.38,48.82 55.38,49.23 56.53,50.38 60.48,50.38 v60.28,50.57
  Bottom 0.406: U3.D7 52.75,58.67 55.05,57.78 56.62,56.52 56.62,52.29 57.98,50.94 59.36,50.76 60.45,50.54 v60.28,50.57
IR_IN
  Bottom 0.254: 33.16,66.11 32.18,65.07 32.18,63.88
  Bottom 0.406: 32.18,63.88 33.23,62.77 35.14,62.47 36.7,61.25 36.7,60.72 U3.D12 | 33.16,66.11 49.4,66.41 71.75,66.32 74.93,66.33 75.08,62.59 75.95,61.12 78.21,61.14 78.53,60.82 IR1.1
IR_OUT1
  Bottom 0.406: U3.D6 54.89,58.82 57.23,56.92 58.38,56.92 59.21,56.01 59.24,53.42 60.05,53.11 62.21,52.78 67.64,52.68 68.36,51.96 68.36,50.36 68.33,50.32 68.32,49.77 68.7,49.34 69.56,48.48 69.58,45.32 67.08,42.81 67.05,35.08 68.97,33.16 69.58,33.16 73.06,28.65 73.01,24.85 67.66,19.77 67.53,15.65 64.77,14.55 62.9,14.23 62.91,10.27 63.25,8.98 62.99,6.07 LED1.K
IR_OUT2
  Bottom 0.406: U3.D5 59.41,57.03 61.9,56.91 62.38,56.94 69.06,56.9 69.58,55.38 69.58,50.8 70.58,49.23 70.58,45.01 67.8,42.26 67.92,40.28 LED2.K
LCD_EN
  Bottom 0.406: U2.6 21.93,63.08 22.79,63.07 | 22.79,63.07 22.53,63.08 | 22.79,63.07 23.45,63.08 31.84,63.08 34.69,60.23 U3.D13
LED3
  Bottom 0.406: U3.D8 47.88,60.07 48.95,58.78 49.98,57.58 53.51,56.7 54.04,55.81 54.09,53.76 54.51,50.51 54.27,49.46 53.88,45.48 55.28,44.4 55.31,40.29 55.2,36.23 55.95,36.65 65.47,36.62 65.78,33.71 67.28,31.79 67.22,28.95 68.13,27.99 70.97,27.06 LED3.K
N$1
  Bottom 0.305: 46.16,61.19 46.13,58.5
  Bottom 0.406: U2.14 43.63,62.56 44.88,62.43 45.83,62.18 46.16,61.19 | 46.13,58.5 46.18,58.29 48.4,57.76 49.52,57.02 50.95,56.69 IC1.8
N$2  (1 unrouted)
  Bottom 0.305: 43.56,61.71 43.54,59.09
  Bottom 0.406: U2.13 40.41,63.07 41.8,63 43.56,61.71 | 43.54,59.09 45.11,57.58 48.02,57.04 IC1.7
N$3  (1 unrouted)
  Bottom 0.406: U2.12 37.87,62.94 39.67,62.63 41.05,62.18 41.04,59.2 41.31,58.21 43.49,57.58 44.63,56.88 45.73,56.77 46.59,56.4 IC1.6
N$4
  Bottom 0.406: IC1.5 45.16,55.2 43.23,56.83 41.46,57.3 39.84,58.25 38.7,58.48 38.48,59.27 38.5,61.72 36.03,62.99 34.19,63.5 33.45,64.24 U2.11
N$5
  Top 0.254: 31.52,47.7 32.02,48.2 U5.P$8 | R5.1 31.23,44.39 31.23,47.4 31.39,47.56 31.52,47.7 | U5.P$8 33.28,48.2 | 33.27,47.7 31.52,47.7 | U5.P$7 U5.P$8
N$6
  Top 0.254: R7.2 24.95,51.38 24.75,51.18 24.75,50.38 U1.9
N$7
  Top 0.254: U1.11 23.73,51.62 23.38,51.98 19.14,51.98 17.93,50.76 17.65,50.53 17.47,50.31 17.48,49.67 R8.1
N$8
  Bottom 0.406: DZ1.2 46.59,17.54 RN3.3
N$9
  Bottom 0.406: DZ1.3 49.05,17.53 RN3.4
N$10  (via drill 0.7)
  Top 0.406: v25.93,54.71 30.84,55.42 v31.14,54.89
  Bottom 0.406: U2.4 15.67,62.36 16.68,61.35 20.38,61.35 v25.93,54.71 | v31.14,54.89 33.34,56.59 33.82,57.07 37.99,57.14 39.65,56.23 39.65,55.42 IC1.3
N$11
  Bottom 0.406: U2.5 18.5,62.98 18.66,62.65 19.93,62.41 30.62,62.43 30.88,61.07 30.92,58.35 32.19,57.75 38.1,57.84 40.2,57.24 40.57,57.03 41.16,56.56 41.97,55.64 IC1.4
N$12
  Top 0.406: LED2.A 72.02,38 66,31.99 66,30.26 RN4.7
N$13
  Bottom 0.406: U2.3 13.13,63.51 12.35,62.73 11.12,62.73 9.68,61.29 7.76,60.51 U8.S
N$14
  cutout Top: 15.62,52.95 33.95,52.61 33.12,38.65 16.2,38.63
  cutout Bottom: 15.71,52.98 16.16,38.78 33.9,38.93 33.84,52.1
N$15  (via drill 0.7)
  Top 0.406: U3.D11 37.8,63.06 24.64,63.06 24.14,63.07 20.17,63.07 19.25,62.15 14.03,62.24 v14.08,62.43
  Bottom 0.406: v14.08,62.43 9.06,60.23 8.64,59.31 8.47,58.19 8.56,56.27 9.25,54.86 9.93,53.98 10.49,53.49 10.81,52.77 10.75,39.56 10.86,37.73 11.44,37.14 11.9,36.55 12.23,35.41 12.23,32.38 10.68,29.53 10.68,24.21 SG1.- 9.37,24.02
N$16
  Bottom 0.406: RN4.2 53.29,28.98 54.26,27.77 54.18,24.44 57.46,21.16 57.46,19.82 DZ1.7
N$17
  Bottom 0.406: RN3.7 55.99,19.33 DZ1.6
N$18
  Bottom 0.406: DZ1.1 44,17.2 RN3.2
N$19
  Top 0.406: IR1.3 78.69,54.61 75.11,58.19 75.11,59.69 C4.1
  Bottom 0.406: C4.1 73.09,61.01 72.57,61.01 R6.1
N$20
  Bottom 0.406: RN4.6 63.45,28.95 64.35,27.98 64.44,25.16 65.26,24.33 68.75,24.33 LED3.A
N$21
  Bottom 0.406: DZ1.4 50.74,17.38 RN3.5
N$22
  Bottom 0.406: DZ1.5 53.89,17.52 RN3.6
N$24
  Top 0.254: 70.26,21.31 73.43,21.1 75.39,19.99 77.85,19.99 U$1.4
  Top 0.305: U3.A1 59.59,12.68 63.37,15.7 66.22,15.7 67.85,17.32 67.85,18.71 70.26,21.31
N$25
  Top 0.254: U1.2 23.23,45.78 C2.1
N$26
  Top 0.305: 73.87,21.95 69.69,22.1 67.24,19.38 67.24,17.78 65.91,16.44 62.97,16.44 60.3,14.17 57.62,14.17 56.53,12.68
  Top 0.406: U3.A0 56.53,12.68 | U$1.3 75.22,21.18 73.87,21.95
  Bottom 0.406: U3.A0 56.53,12.84 55.32,14.05 52.68,14.05 52.45,14.28 50.57,14.28 50.32,14.02 47.68,14.02 47.4,14.3 45.49,14.3 45.24,14.05 43.38,14.05 42.57,13.23 42.57,10.13 40.89,8.46 41.09,8.26 C5.+
N$29
  Bottom 0.406: RN4.3 55.83,29.16 56.84,27.65 56.88,24.38 60.05,21.2 60.05,19.77 DZ1.8
N$30
  Bottom 0.406: RN4.4 58.37,29.04 59.34,27.78 59.45,24.09 63.19,20.36 63.19,19.2 DZ1.9
N$31
  Bottom 0.406: RN4.5 60.91,28.98 61.87,27.75 61.99,23.82 65.22,20.6 65.22,19.69 DZ1.10
N$32
  Bottom 0.305: RN3.8 60.37,14.19
  Bottom 0.406: 60.37,14.19 60.38,9.71 60.14,6.89 LED1.A
POT  (via drill 0.7)
  Top 0.406: U3.A3 64.15,11.05 65.31,9.72 66.81,9.48 67.59,7.49 69.14,5.7 72.65,5.73 v75.36,7.64
  Bottom 0.406: U7.P$2 74.76,3.75 74.83,4.58 v75.36,7.64
RX
  Bottom 0.406: U3.D0 69.23,61.46 JP3.2
SCL  (via drill 0.7 pad 0.41)
  Top 0.254: 31.36,42.32 31.84,42.8 31.84,47.12 31.86,47.19 32.5,47.19 U5.P$6
  Top 0.305: 31.36,42.32 30.44,42.32 U4.2
  Top 0.406: IC1.12 60.65,52.7 46.5,52.69 v44.59,52.1
  Bottom 0.406: U3.SCL 24.53,59.99 29.12,53.01 32.81,52.91 36.16,49.44 | 36.16,49.44 43.84,49.5 | IC2.1 43.83,44.77 43.78,44.82 43.83,49.1 43.83,49.49 43.84,49.5 | 36.16,49.44 34.38,49.44 33.58,48.64 33.58,39.94 32.46,38.82 30.22,38.82 U4.2 | v44.59,52.1 45.04,50.7 43.84,49.5
SCL1
  Bottom 0.305: U3.A5 69.23,12.38 67.79,13.82 66.02,13.82 65.41,13.21 65.41,10.16 64.34,9.09
  Bottom 0.406: 64.34,9.09 64.34,4.34 63.25,3.25 58.88,3.25 58.04,2.41 48.43,2.41 U6.2
SCL_3
  Top 0.254: U5.P$3 30.5,47.2 | 30.5,47.2 30.52,47.19 30.62,47.22 30.77,47.61 31.9,48.8 31.93,50.43 R3.1 | U1.4 24.23,46.69 24.05,46.51 24.05,45.04 24.25,44.84 26.01,44.84 26.25,44.61 29.35,44.61 30.55,45.81 30.55,47.15 30.5,47.2
SDA  (via drill 0.7 pad 0.41)
  Top 0.254: U5.P$5 33.08,46.7 32.55,46.56
  Top 0.406: IC2.2 46.74,40.53 45.37,39.16 44.85,39.12 42.91,37.17 33.84,37.26 31.12,39.98 U4.1 32.34,40.97 32.55,41.17 32.55,46.56 | v46.87,50.03 43.05,50.03 v40.78,50.81 45.87,50.81 46.77,51.72 62.22,51.72 IC1.13
  Bottom 0.406: U3.SDA 27.07,59.1 29.6,53.87 32.56,53.84 34.27,53.16 36.72,50.38 v40.78,50.81 | IC2.2 46.52,48.85 46.91,49.86 46.99,49.9 v46.87,50.03
SDA1
  Bottom 0.305: 44.08,4.47 U6.1
  Bottom 0.406: 44.08,4.47 44.08,3.03 45.05,2.52 45.94,1.63 58.29,1.63 58.95,2.29 63.45,2.29 65.96,4.8 66.65,4.8 67.49,5.64 67.49,8.08 66.69,8.88 U3.A4
SDA_3
  Top 0.254: U5.P$4 29.42,46.7 28.61,45.89 28.07,45.89 R4.1 27.59,45.78 26.91,45.78 26.91,47.67 26.66,47.97 26.28,48.51 U1.6
SVO1  (via drill 0.8)
  Top 0.406: SERVO1.1 58.63,62.41 | 44.85,60.63 U3.D9 45.04,60.2 45.84,62.17 48.89,62.16 49.43,62.37 58.63,62.41 | 58.63,62.41 67.2,62.41 67.94,61.67 67.94,58.73 68.76,57.91 70.76,57.91 v71.48,57.2
  Top 0.61: v79.96,35.84 79.96,32.28 78.36,28.35 78.28,28.19 77.65,27.56 76.53,26.72 U$1.7
  Bottom 0.406: v71.48,57.2 74.37,57.2 75.03,56.54 75.74,56.54 76.53,55.75 76.53,53.16 78.08,51.61 78.08,49.76 78.87,48.97 78.87,48.9 81.38,46.38 80.7,36.55
  Bottom 0.61: 80.7,36.55 80.67,36.55 v79.96,35.84
SVO2  (via drill 0.8)
  Top 0.406: U3.D10 42.31,61.6 42.32,62.48 43.09,62.95 49.39,63.11 SERVO.1
  Top 0.61: v81.33,32.59 79.88,28.25 U$1.8
  Bottom 0.406: SERVO.1 51.68,64.23 53.11,65.66 73.51,65.66 74.3,64.87 74.3,63.81 73.08,62.59 71.93,62.59 70.56,61.21 70.56,59.59 72.21,57.94 73.97,57.94 77.24,57.23 77.32,53.59 78.54,52.38 81.53,52.38 82.04,51.87 82.02,34.82
  Bottom 0.61: 82.02,34.82 81.99,33.4 v81.33,32.59
SWITCH
  Top 0.406: SW2.2 76.34,45.75 76.34,44.98 75.58,43.95 71.92,43.95 R9.2
SWITCHR
  Bottom 0.305: 62.9,57.78 63.05,57.76
  Bottom 0.406: R9.1 70.72,52.18 70.52,52.93 70.45,56.91 69.55,57.72 63.24,57.77 62.9,57.78 | 63.05,57.76 62.6,57.74 60.01,57.68 U3.D4
TEMP
  Top 0.406: U$1.1 76.81,17.71 76.37,17.26 75.86,14.03 73.58,12.89 71.06,13.33 69.09,14.49 63.54,14.08 U3.A2 61.03,10.91 59.79,9.68 58.42,9.68 57.78,9.04 57.78,7.99 R2.1
  Bottom 0.406: R1.1 61.57,11.77 U3.A2
TX
  Bottom 0.406: JP3.1 68.28,63.04 66.75,61.42 66.75,60.13 U3.D1
VCC  (via drill 0.7)
  Top 0.254: R5.2 26.2,43.3 C1.1 | IC3.1 19.5,43.94 19.5,44.69 19.75,44.95 20.87,44.95 21.32,44.51 IC3.3 21.75,44.3 | 26.14,41.06 U4.3
  Top 0.305: 21.75,44.3 25.32,44.3 26.14,43.57 C1.1 26.14,42.13 26.14,41.06
  Top 0.406: IC2.6 56.65,42.31 | SW2.1 73.86,45.46 68.25,51.07 70.01,52.11 70.76,52.11 R6.2 | U$1.2 78.94,17.58 78.18,17.15 77.7,14.4 75.82,12.52 v76.63,11.28
  Top 0.61: U2.B2 10.72,31.87 27.01,31.84 28.32,32.38 32.27,31.91 33.67,32.35 39.85,32.17 40,32.32 | 43.84,11.95 43.84,12.72 41.98,14.57 41.98,15.7 RN3.1 41.15,16.54 41.15,26.83 40,28.28 40,32.32 | 43.07,33.53 IC2.18 43.91,34.78 43.91,36.3 29.84,36.3 26.04,40.1 U4.3 | 43.07,33.53 42.08,32.35 40,32.32 | U3.5V 43.79,9.51 45.35,6.49 45.63,6.22 48.3,6.22 49.29,5.23 U6.3 | U7.P$3 77.7,3.07 76.91,3.13 67.77,3.15 67.14,3.73 64.63,3.7 62.71,2.46 50.09,2.55 49.46,2.99 49.46,4.43 U6.3 | R2.2 50.35,5.66 U6.3 | RN4.1 49.58,30.24 47.34,32.48 44.12,32.48 43.07,33.53 | 61.43,49.72 IC1.18 | IC1.16 65.48,48.2 63.54,50.13 | IC2.4 IC2.5 IC2.6
  Top 0.813: 68.25,51.07 63.54,50.13 61.43,49.72 | 56.65,42.31 56.62,42.04 | IC1.18 60.37,47.4 | U3.5V 43.84,11.95
  Bottom 0.406: IC1.9 55.24,55.07 | SERVO.2 53.83,64.13 55.11,62.51 60.78,62.46 SERVO1.2 | v76.63,11.28 75.82,9.83 77.42,8.23 77.42,2.01 U7.P$3
  Bottom 0.45: 53.91,57.37 50.44,58.16
  Bottom 0.5: 50.44,58.16 49.83,59.49
  Bottom 0.61: 55.24,55.07 54.83,56.71 53.91,57.37 | 49.83,59.49 49.96,62.38 | 49.96,62.38 53.44,62.44 SERVO.2 | IC1.9 56.24,49.67 59.55,49.41 IC1.18 | U2.15 45.25,63.13 46.2,62.94 49.35,62.91 49.41,61.18 49.96,62.38 | IC2.18 43.83,36.33 45.97,38.47 49.76,38.47 51.45,40.17 IC2.4
  Bottom 0.813: U2.2 10.59,64.09 9.24,62.46 U8.A 4.41,61.05 4.41,58.52 9.45,53.3 9.2,38.19 9.87,35.97 9.94,35.93 10.2,35.27 10.2,34.44 U2.B2 | IC1.18 60.4,46.11 59.11,44.82 56.87,44.82 56.55,44.09 56.55,42.16 IC2.6

### Text on the board
Top: GG
Bottom: GG
tPlace: PWM | PWM | TX | RX | + | - | + | - | S2 | S1 | R6 | Accelerometer | 4k7 | 4.7uF | 500 | 500 | U1 | 4k7 | U5 | IC3 | 0.1uF | 200k | 1uF | LED2 | INT2 | INT1 | GND | +5V | SCL | SDA | RN1 | RN2 | RN4 | LED3 | GND | - | + | Button | Side with | writing | A0 | Analog | A1 | RN3 | Vin | +3V | +5V | GND | Thermistor | R2 | Button | Button | Button | LED1 | SDA | SCL | +5V | GND | INT1 | INT2
bPlace: C4 | R9 | INT1 | GND | +5V | INT2 | SDA | SCL | VGA | Hsync | Vsync | gnd | gnd | grn | red | power | blue
Reference: Keep this open for servo, LED access | 24mm | 82.09 | shield + LCD | 77.52, 64.39 | LCD Board | LCD screen | Switch - sticks out the side | USB B port | 41.00 -> 53.75 | This LED points out this side | 77.49, 33.46 | shield + LCD | Buzzer | 67.25, 27.44 | Can be covered | LED Bar Graph | 2.46, 33.43 | 67.38 | shield + LCD | 41.83, 17.27 | 77.86, 16.91 | Arduino+shield | Knob for potentiometer | Power Jack | 74.30, 8.30 | 11.75 -> 21.75 | 0.00, 0.00 | 62.86 | 19.94, 9.27 | 6.97, 9.32 | 33.04, 9.22 | This LED points out this side | 20.15, 24.12 | Buttons. 12mm square heads | All Dimensions in mm
binstruct: 21 | 18 | Install Pot. | 17 | here | 26 | 2 | IR reciever | match up | the indent | Place MCP23017 here. | 8 | Install | switch | Solder on the other side. | here | 7 | 6 | LEDs | Install | Place MCP23008 here. | 9 | the indent | match up | Solder on the other side. | like this | 19 | 1 | pointing this way | Headers | 20 | Put / Your / Initials / Here
tInstruct: 28 | LCD | Install Arduino headers on the other side | Solder on this side. | Before installing LCD / Run all test programs | 16 | Install this chip | on the other side | This circuit may | be pre-installed | If not, install a | daughter board | as last step | For steps | 19 & 20 | Solder LEDs | 27 | Install this chip | 6mm away | on the other side | from board | 12 | 3 | arrow goes here | 14 | 22 | 5 | Bargraph | 11 | 13 | Speaker | 4 | 10 | arrow goes here | 15 | 25 | 23 | 24 | Potentiometer
bGeneralInstruct: Hackerling | Circuit | 1.3 | v | For information about | this circuit, | or the Hacker Scouts | program, | This Circuit is Open Source! | go to: | circuit.hackersource.net | www.hackersource.net